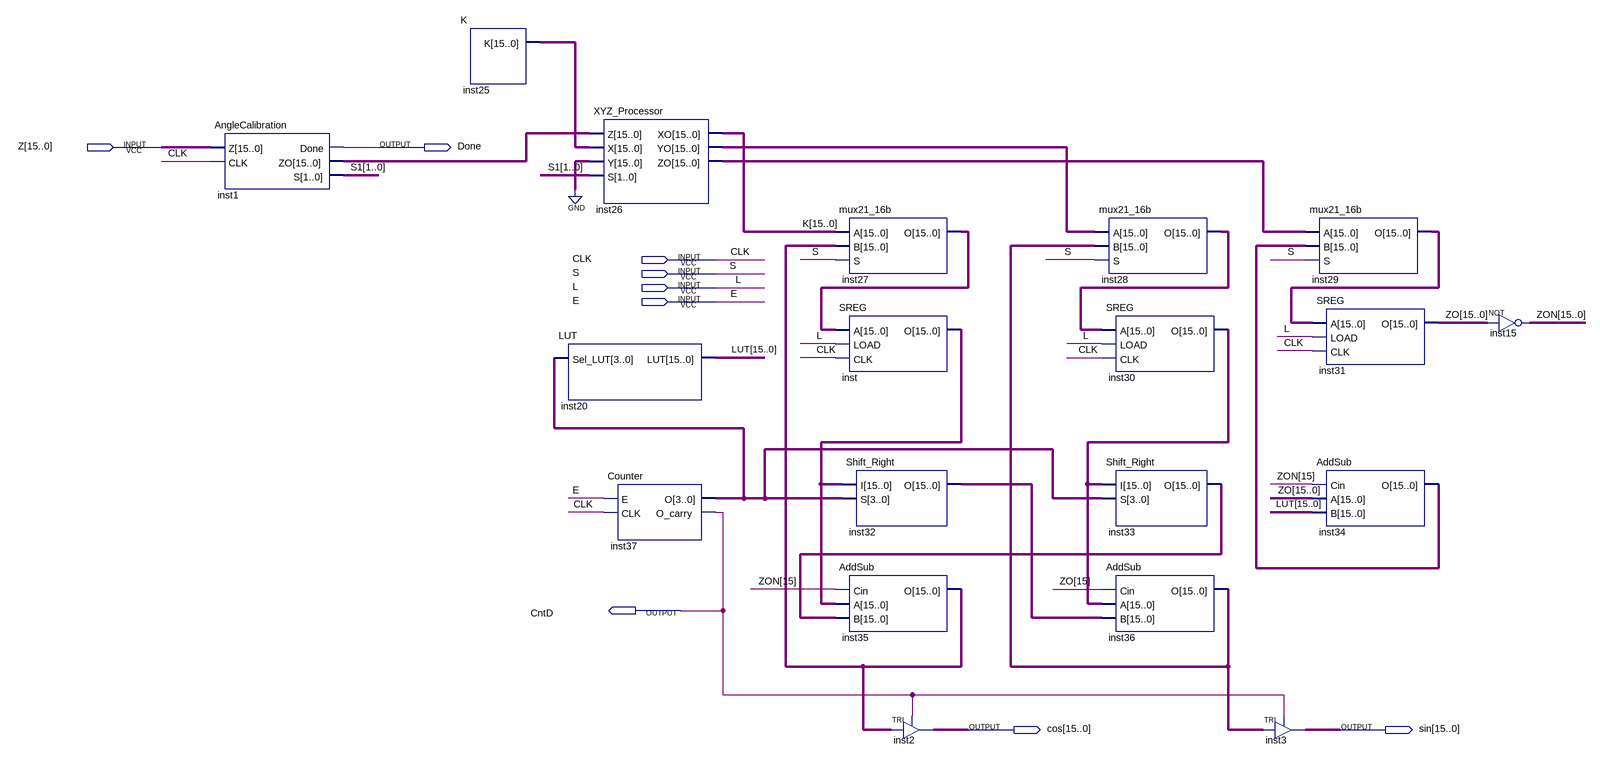
[diagram p0: schematic sheet]
// Quartus schematic datapath.bdf as structural Verilog: 19 symbols, 9 pins
module datapath (
  input  [15:0] Z,
  input  CLK,
  input  S,
  input  L,
  input  E,
  output Done,
  output CntD,
  output [15:0] cos,
  output [15:0] sin
);

  wire [1:0] S1;
  wire [3:0] inst37_o;
  wire [15:0] inst1_zo, inst25_k, inst26_yo, inst26_zo, inst27_o, inst28_o, inst29_o, inst30_o, inst32_o,
       inst33_o, inst34_o, inst35_o, inst36_o, inst_o, K, LUT, ZO, ZON;

  AngleCalibration inst1 (.Z(Z), .CLK(CLK), .Done(Done), .ZO(inst1_zo), .S(S1));
  K inst25 (.K(inst25_k));
  XYZ_Processor inst26 (.Z(inst1_zo), .X(inst25_k), .Y({16{1'b0}}), .S(S1), .XO(K), .YO(inst26_yo), .ZO(inst26_zo));
  LUT inst20 (.Sel_LUT(inst37_o), .LUT(LUT));
  Counter inst37 (.E(E), .CLK(CLK), .O(inst37_o), .O_carry(CntD));
  mux21_16b inst27 (.A(K), .B(inst35_o), .S(S), .O(inst27_o));
  SREG inst (.A(inst27_o), .LOAD(L), .CLK(CLK), .O(inst_o));
  Shift_Right inst32 (.I(inst_o), .S(inst37_o), .O(inst32_o));
  AddSub inst35 (.Cin(ZON[15]), .A(inst_o), .B(inst33_o), .O(inst35_o));
  TRI inst2[15:0] (.IN(inst35_o), .OE(CntD), .OUT(cos));
  mux21_16b inst28 (.A(inst26_yo), .B(inst36_o), .S(S), .O(inst28_o));
  SREG inst30 (.A(inst28_o), .LOAD(L), .CLK(CLK), .O(inst30_o));
  Shift_Right inst33 (.I(inst30_o), .S(inst37_o), .O(inst33_o));
  AddSub inst36 (.Cin(ZO[15]), .A(inst30_o), .B(inst32_o), .O(inst36_o));
  TRI inst3[15:0] (.IN(inst36_o), .OE(CntD), .OUT(sin));
  mux21_16b inst29 (.A(inst26_zo), .B(inst34_o), .S(S), .O(inst29_o));
  SREG inst31 (.A(inst29_o), .LOAD(L), .CLK(CLK), .O(ZO));
  AddSub inst34 (.Cin(ZON[15]), .A(ZO), .B(LUT), .O(inst34_o));
  assign ZON = ~ZO;  // NOT inst15, 16 bits wide
endmodule
